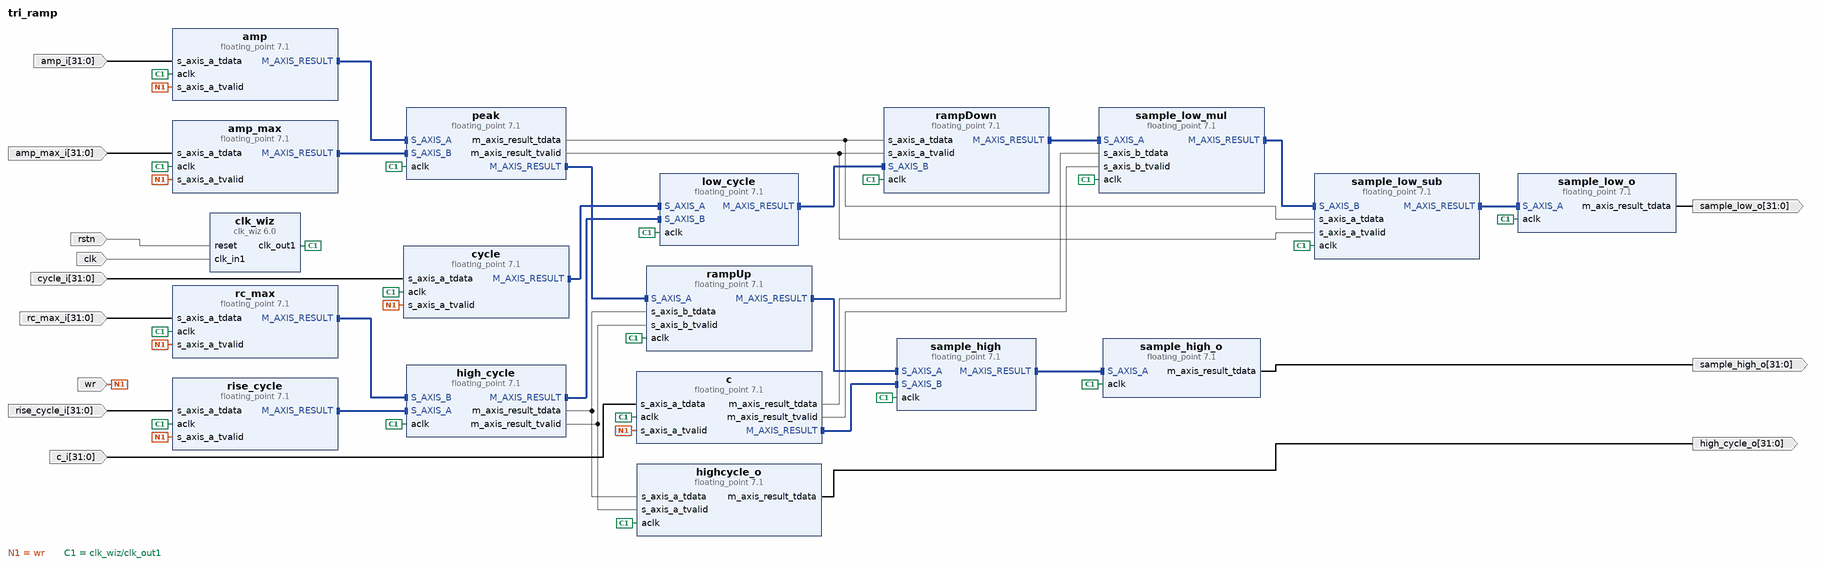
[diagram p0: block diagram of the top level]
# Vivado block design tri_ramp, xc7a100tcsg324-1, Vivado 2019.2
create_bd_design tri_ramp

create_bd_port -dir I -from 31 -to 0 rc_max_i
create_bd_port -dir I -from 31 -to 0 c_i
create_bd_port -dir I -from 31 -to 0 rise_cycle_i
create_bd_port -dir I -from 31 -to 0 amp_i
create_bd_port -dir I -from 31 -to 0 amp_max_i
create_bd_port -dir I -from 31 -to 0 cycle_i
create_bd_port -dir I wr
create_bd_port -dir O -from 31 -to 0 sample_high_o
create_bd_port -dir O -from 31 -to 0 sample_low_o
create_bd_port -dir O -from 31 -to 0 high_cycle_o
create_bd_port -dir I -type rst rstn
set_property -dict {CONFIG.POLARITY ACTIVE_HIGH} [get_bd_ports rstn]
create_bd_port -dir I -type clk clk

create_bd_cell -type ip -vlnv xilinx.com:ip:floating_point:7.1 amp
set_property -dict [list \
  CONFIG.C_Accum_Input_Msb 32 \
  CONFIG.C_Accum_Lsb -31 \
  CONFIG.C_Accum_Msb 32 \
  CONFIG.C_Latency 6 \
  CONFIG.C_Mult_Usage No_Usage \
  CONFIG.C_Rate 1 \
  CONFIG.C_Result_Exponent_Width 8 \
  CONFIG.C_Result_Fraction_Width 24 \
  CONFIG.Flow_Control NonBlocking \
  CONFIG.Has_RESULT_TREADY false \
  CONFIG.Operation_Type Fixed_to_float \
  CONFIG.Result_Precision_Type Single \
] [get_bd_cells amp]
create_bd_cell -type ip -vlnv xilinx.com:ip:floating_point:7.1 peak
set_property -dict [list \
  CONFIG.C_Accum_Input_Msb 32 \
  CONFIG.C_Accum_Lsb -31 \
  CONFIG.C_Accum_Msb 32 \
  CONFIG.C_Latency 28 \
  CONFIG.C_Mult_Usage No_Usage \
  CONFIG.C_Rate 1 \
  CONFIG.C_Result_Exponent_Width 8 \
  CONFIG.C_Result_Fraction_Width 24 \
  CONFIG.Flow_Control NonBlocking \
  CONFIG.Has_RESULT_TREADY false \
  CONFIG.Operation_Type Divide \
  CONFIG.Result_Precision_Type Single \
] [get_bd_cells peak]
create_bd_cell -type ip -vlnv xilinx.com:ip:floating_point:7.1 amp_max
set_property -dict [list \
  CONFIG.C_Accum_Input_Msb 32 \
  CONFIG.C_Accum_Lsb -31 \
  CONFIG.C_Accum_Msb 32 \
  CONFIG.C_Latency 6 \
  CONFIG.C_Mult_Usage No_Usage \
  CONFIG.C_Rate 1 \
  CONFIG.C_Result_Exponent_Width 8 \
  CONFIG.C_Result_Fraction_Width 24 \
  CONFIG.Flow_Control NonBlocking \
  CONFIG.Has_RESULT_TREADY false \
  CONFIG.Operation_Type Fixed_to_float \
  CONFIG.Result_Precision_Type Single \
] [get_bd_cells amp_max]
create_bd_cell -type ip -vlnv xilinx.com:ip:floating_point:7.1 cycle
set_property -dict [list \
  CONFIG.C_Accum_Input_Msb 32 \
  CONFIG.C_Accum_Lsb -31 \
  CONFIG.C_Accum_Msb 32 \
  CONFIG.C_Latency 6 \
  CONFIG.C_Mult_Usage No_Usage \
  CONFIG.C_Rate 1 \
  CONFIG.C_Result_Exponent_Width 8 \
  CONFIG.C_Result_Fraction_Width 24 \
  CONFIG.Flow_Control NonBlocking \
  CONFIG.Has_RESULT_TREADY false \
  CONFIG.Operation_Type Fixed_to_float \
  CONFIG.Result_Precision_Type Single \
] [get_bd_cells cycle]
create_bd_cell -type ip -vlnv xilinx.com:ip:floating_point:7.1 rc_max
set_property -dict [list \
  CONFIG.C_Accum_Input_Msb 32 \
  CONFIG.C_Accum_Lsb -31 \
  CONFIG.C_Accum_Msb 32 \
  CONFIG.C_Latency 6 \
  CONFIG.C_Mult_Usage No_Usage \
  CONFIG.C_Rate 1 \
  CONFIG.C_Result_Exponent_Width 8 \
  CONFIG.C_Result_Fraction_Width 24 \
  CONFIG.Flow_Control NonBlocking \
  CONFIG.Has_RESULT_TREADY false \
  CONFIG.Operation_Type Fixed_to_float \
  CONFIG.Result_Precision_Type Single \
] [get_bd_cells rc_max]
create_bd_cell -type ip -vlnv xilinx.com:ip:floating_point:7.1 c
set_property -dict [list \
  CONFIG.C_Accum_Input_Msb 32 \
  CONFIG.C_Accum_Lsb -31 \
  CONFIG.C_Accum_Msb 32 \
  CONFIG.C_Latency 6 \
  CONFIG.C_Mult_Usage No_Usage \
  CONFIG.C_Rate 1 \
  CONFIG.C_Result_Exponent_Width 8 \
  CONFIG.C_Result_Fraction_Width 24 \
  CONFIG.Flow_Control NonBlocking \
  CONFIG.Has_RESULT_TREADY false \
  CONFIG.Operation_Type Fixed_to_float \
  CONFIG.Result_Precision_Type Single \
] [get_bd_cells c]
create_bd_cell -type ip -vlnv xilinx.com:ip:floating_point:7.1 rise_cycle
set_property -dict [list \
  CONFIG.C_Accum_Input_Msb 32 \
  CONFIG.C_Accum_Lsb -31 \
  CONFIG.C_Accum_Msb 32 \
  CONFIG.C_Latency 6 \
  CONFIG.C_Mult_Usage No_Usage \
  CONFIG.C_Rate 1 \
  CONFIG.C_Result_Exponent_Width 8 \
  CONFIG.C_Result_Fraction_Width 24 \
  CONFIG.Flow_Control NonBlocking \
  CONFIG.Has_RESULT_TREADY false \
  CONFIG.Operation_Type Fixed_to_float \
  CONFIG.Result_Precision_Type Single \
] [get_bd_cells rise_cycle]
create_bd_cell -type ip -vlnv xilinx.com:ip:floating_point:7.1 sample_low_sub
set_property -dict [list \
  CONFIG.Add_Sub_Value Subtract \
  CONFIG.C_Accum_Input_Msb 32 \
  CONFIG.C_Accum_Lsb -31 \
  CONFIG.C_Accum_Msb 32 \
  CONFIG.C_Latency 11 \
  CONFIG.C_Mult_Usage Full_Usage \
  CONFIG.C_Rate 1 \
  CONFIG.C_Result_Exponent_Width 8 \
  CONFIG.C_Result_Fraction_Width 24 \
  CONFIG.Flow_Control NonBlocking \
  CONFIG.Has_RESULT_TREADY false \
  CONFIG.Operation_Type Add_Subtract \
  CONFIG.Result_Precision_Type Single \
] [get_bd_cells sample_low_sub]
create_bd_cell -type ip -vlnv xilinx.com:ip:floating_point:7.1 rampDown
set_property -dict [list \
  CONFIG.C_Accum_Input_Msb 32 \
  CONFIG.C_Accum_Lsb -31 \
  CONFIG.C_Accum_Msb 32 \
  CONFIG.C_Latency 28 \
  CONFIG.C_Mult_Usage No_Usage \
  CONFIG.C_Rate 1 \
  CONFIG.C_Result_Exponent_Width 8 \
  CONFIG.C_Result_Fraction_Width 24 \
  CONFIG.Flow_Control NonBlocking \
  CONFIG.Has_RESULT_TREADY false \
  CONFIG.Operation_Type Divide \
  CONFIG.Result_Precision_Type Single \
] [get_bd_cells rampDown]
create_bd_cell -type ip -vlnv xilinx.com:ip:floating_point:7.1 high_cycle
set_property -dict [list \
  CONFIG.C_Accum_Input_Msb 32 \
  CONFIG.C_Accum_Lsb -31 \
  CONFIG.C_Accum_Msb 32 \
  CONFIG.C_Latency 28 \
  CONFIG.C_Mult_Usage No_Usage \
  CONFIG.C_Rate 1 \
  CONFIG.C_Result_Exponent_Width 8 \
  CONFIG.C_Result_Fraction_Width 24 \
  CONFIG.Flow_Control NonBlocking \
  CONFIG.Has_RESULT_TREADY false \
  CONFIG.Operation_Type Divide \
  CONFIG.Result_Precision_Type Single \
] [get_bd_cells high_cycle]
create_bd_cell -type ip -vlnv xilinx.com:ip:floating_point:7.1 rampUp
set_property -dict [list \
  CONFIG.C_Accum_Input_Msb 32 \
  CONFIG.C_Accum_Lsb -31 \
  CONFIG.C_Accum_Msb 32 \
  CONFIG.C_Latency 28 \
  CONFIG.C_Mult_Usage No_Usage \
  CONFIG.C_Rate 1 \
  CONFIG.C_Result_Exponent_Width 8 \
  CONFIG.C_Result_Fraction_Width 24 \
  CONFIG.Flow_Control NonBlocking \
  CONFIG.Has_RESULT_TREADY false \
  CONFIG.Operation_Type Divide \
  CONFIG.Result_Precision_Type Single \
] [get_bd_cells rampUp]
create_bd_cell -type ip -vlnv xilinx.com:ip:floating_point:7.1 sample_low_mul
set_property -dict [list \
  CONFIG.C_Accum_Input_Msb 32 \
  CONFIG.C_Accum_Lsb -31 \
  CONFIG.C_Accum_Msb 32 \
  CONFIG.C_Latency 28 \
  CONFIG.C_Mult_Usage No_Usage \
  CONFIG.C_Rate 1 \
  CONFIG.C_Result_Exponent_Width 8 \
  CONFIG.C_Result_Fraction_Width 24 \
  CONFIG.Flow_Control NonBlocking \
  CONFIG.Has_RESULT_TREADY false \
  CONFIG.Operation_Type Divide \
  CONFIG.Result_Precision_Type Single \
] [get_bd_cells sample_low_mul]
create_bd_cell -type ip -vlnv xilinx.com:ip:floating_point:7.1 low_cycle
set_property -dict [list \
  CONFIG.Add_Sub_Value Subtract \
  CONFIG.C_Accum_Input_Msb 32 \
  CONFIG.C_Accum_Lsb -31 \
  CONFIG.C_Accum_Msb 32 \
  CONFIG.C_Latency 11 \
  CONFIG.C_Mult_Usage Full_Usage \
  CONFIG.C_Rate 1 \
  CONFIG.C_Result_Exponent_Width 8 \
  CONFIG.C_Result_Fraction_Width 24 \
  CONFIG.Flow_Control NonBlocking \
  CONFIG.Has_RESULT_TREADY false \
  CONFIG.Operation_Type Add_Subtract \
  CONFIG.Result_Precision_Type Single \
] [get_bd_cells low_cycle]
create_bd_cell -type ip -vlnv xilinx.com:ip:floating_point:7.1 sample_high
set_property -dict [list \
  CONFIG.C_Accum_Input_Msb 32 \
  CONFIG.C_Accum_Lsb -31 \
  CONFIG.C_Accum_Msb 32 \
  CONFIG.C_Latency 28 \
  CONFIG.C_Mult_Usage No_Usage \
  CONFIG.C_Rate 1 \
  CONFIG.C_Result_Exponent_Width 8 \
  CONFIG.C_Result_Fraction_Width 24 \
  CONFIG.Flow_Control NonBlocking \
  CONFIG.Has_RESULT_TREADY false \
  CONFIG.Operation_Type Divide \
  CONFIG.Result_Precision_Type Single \
] [get_bd_cells sample_high]
create_bd_cell -type ip -vlnv xilinx.com:ip:floating_point:7.1 highcycle_o
set_property -dict [list \
  CONFIG.C_Accum_Input_Msb 32 \
  CONFIG.C_Accum_Lsb -31 \
  CONFIG.C_Accum_Msb 32 \
  CONFIG.C_Latency 6 \
  CONFIG.C_Mult_Usage No_Usage \
  CONFIG.C_Rate 1 \
  CONFIG.C_Result_Exponent_Width 32 \
  CONFIG.C_Result_Fraction_Width 0 \
  CONFIG.Flow_Control NonBlocking \
  CONFIG.Has_RESULT_TREADY false \
  CONFIG.Operation_Type Float_to_fixed \
  CONFIG.Result_Precision_Type Int32 \
] [get_bd_cells highcycle_o]
create_bd_cell -type ip -vlnv xilinx.com:ip:floating_point:7.1 sample_high_o
set_property -dict [list \
  CONFIG.C_Accum_Input_Msb 32 \
  CONFIG.C_Accum_Lsb -31 \
  CONFIG.C_Accum_Msb 32 \
  CONFIG.C_Latency 6 \
  CONFIG.C_Mult_Usage No_Usage \
  CONFIG.C_Rate 1 \
  CONFIG.C_Result_Exponent_Width 32 \
  CONFIG.C_Result_Fraction_Width 0 \
  CONFIG.Flow_Control NonBlocking \
  CONFIG.Has_RESULT_TREADY false \
  CONFIG.Operation_Type Float_to_fixed \
  CONFIG.Result_Precision_Type Int32 \
] [get_bd_cells sample_high_o]
create_bd_cell -type ip -vlnv xilinx.com:ip:floating_point:7.1 sample_low_o
set_property -dict [list \
  CONFIG.C_Accum_Input_Msb 32 \
  CONFIG.C_Accum_Lsb -31 \
  CONFIG.C_Accum_Msb 32 \
  CONFIG.C_Latency 6 \
  CONFIG.C_Mult_Usage No_Usage \
  CONFIG.C_Rate 1 \
  CONFIG.C_Result_Exponent_Width 32 \
  CONFIG.C_Result_Fraction_Width 0 \
  CONFIG.Flow_Control NonBlocking \
  CONFIG.Has_RESULT_TREADY false \
  CONFIG.Operation_Type Float_to_fixed \
  CONFIG.Result_Precision_Type Int32 \
] [get_bd_cells sample_low_o]
create_bd_cell -type ip -vlnv xilinx.com:ip:clk_wiz:6.0 clk_wiz

# ---- connections ----

connect_bd_intf_net [get_bd_intf_pins sample_high/S_AXIS_B] [get_bd_intf_pins c/M_AXIS_RESULT]
connect_bd_intf_net [get_bd_intf_pins rampUp/M_AXIS_RESULT] [get_bd_intf_pins sample_high/S_AXIS_A]
connect_bd_intf_net [get_bd_intf_pins amp/M_AXIS_RESULT] [get_bd_intf_pins peak/S_AXIS_A]
connect_bd_intf_net [get_bd_intf_pins rise_cycle/M_AXIS_RESULT] [get_bd_intf_pins high_cycle/S_AXIS_A]
connect_bd_intf_net [get_bd_intf_pins amp_max/M_AXIS_RESULT] [get_bd_intf_pins peak/S_AXIS_B]
connect_bd_intf_net [get_bd_intf_pins rc_max/M_AXIS_RESULT] [get_bd_intf_pins high_cycle/S_AXIS_B]
connect_bd_intf_net [get_bd_intf_pins low_cycle/M_AXIS_RESULT] [get_bd_intf_pins rampDown/S_AXIS_B]
connect_bd_intf_net [get_bd_intf_pins cycle/M_AXIS_RESULT] [get_bd_intf_pins low_cycle/S_AXIS_A]
connect_bd_intf_net [get_bd_intf_pins high_cycle/M_AXIS_RESULT] [get_bd_intf_pins low_cycle/S_AXIS_B]
connect_bd_intf_net [get_bd_intf_pins peak/M_AXIS_RESULT] [get_bd_intf_pins rampUp/S_AXIS_A]
connect_bd_intf_net [get_bd_intf_pins sample_low_mul/M_AXIS_RESULT] [get_bd_intf_pins sample_low_sub/S_AXIS_B]
connect_bd_intf_net [get_bd_intf_pins rampDown/M_AXIS_RESULT] [get_bd_intf_pins sample_low_mul/S_AXIS_A]
connect_bd_intf_net [get_bd_intf_pins sample_high_o/S_AXIS_A] [get_bd_intf_pins sample_high/M_AXIS_RESULT]
connect_bd_intf_net [get_bd_intf_pins sample_low_o/S_AXIS_A] [get_bd_intf_pins sample_low_sub/M_AXIS_RESULT]
connect_bd_net -net s_axis_a_tdata_0_1 [get_bd_ports rc_max_i] [get_bd_pins rc_max/s_axis_a_tdata]
connect_bd_net -net s_axis_a_tdata_1_1 [get_bd_ports c_i] [get_bd_pins c/s_axis_a_tdata]
connect_bd_net -net s_axis_a_tdata_2_1 [get_bd_ports rise_cycle_i] [get_bd_pins rise_cycle/s_axis_a_tdata]
connect_bd_net -net s_axis_a_tdata_3_1 [get_bd_ports amp_i] [get_bd_pins amp/s_axis_a_tdata]
connect_bd_net -net s_axis_a_tdata_4_1 [get_bd_ports amp_max_i] [get_bd_pins amp_max/s_axis_a_tdata]
connect_bd_net -net s_axis_a_tdata_5_1 [get_bd_ports cycle_i] [get_bd_pins cycle/s_axis_a_tdata]
connect_bd_net -net s_axis_a_tvalid_0_1 [get_bd_ports wr] \
  [get_bd_pins amp/s_axis_a_tvalid] [get_bd_pins amp_max/s_axis_a_tvalid] [get_bd_pins rise_cycle/s_axis_a_tvalid] \
  [get_bd_pins rc_max/s_axis_a_tvalid] [get_bd_pins c/s_axis_a_tvalid] [get_bd_pins cycle/s_axis_a_tvalid]
connect_bd_net [get_bd_pins sample_high_o/m_axis_result_tdata] [get_bd_ports sample_high_o]
connect_bd_net [get_bd_pins sample_low_o/m_axis_result_tdata] [get_bd_ports sample_low_o]
connect_bd_net [get_bd_pins highcycle_o/m_axis_result_tdata] [get_bd_ports high_cycle_o]
connect_bd_net [get_bd_pins high_cycle/m_axis_result_tdata] [get_bd_pins rampUp/s_axis_b_tdata] [get_bd_pins highcycle_o/s_axis_a_tdata]
connect_bd_net [get_bd_pins high_cycle/m_axis_result_tvalid] [get_bd_pins rampUp/s_axis_b_tvalid] [get_bd_pins highcycle_o/s_axis_a_tvalid]
connect_bd_net [get_bd_pins peak/m_axis_result_tdata] [get_bd_pins rampDown/s_axis_a_tdata] [get_bd_pins sample_low_sub/s_axis_a_tdata]
connect_bd_net [get_bd_pins peak/m_axis_result_tvalid] [get_bd_pins rampDown/s_axis_a_tvalid] [get_bd_pins sample_low_sub/s_axis_a_tvalid]
connect_bd_net [get_bd_pins c/m_axis_result_tdata] [get_bd_pins sample_low_mul/s_axis_b_tdata]
connect_bd_net [get_bd_pins c/m_axis_result_tvalid] [get_bd_pins sample_low_mul/s_axis_b_tvalid]
connect_bd_net [get_bd_pins clk_wiz/clk_out1] \
  [get_bd_pins high_cycle/aclk] [get_bd_pins low_cycle/aclk] [get_bd_pins rc_max/aclk] [get_bd_pins rise_cycle/aclk] \
  [get_bd_pins amp/aclk] [get_bd_pins amp_max/aclk] [get_bd_pins c/aclk] [get_bd_pins cycle/aclk] \
  [get_bd_pins sample_low_mul/aclk] [get_bd_pins rampDown/aclk] [get_bd_pins rampUp/aclk] [get_bd_pins sample_high/aclk] \
  [get_bd_pins sample_low_sub/aclk] [get_bd_pins sample_low_o/aclk] [get_bd_pins sample_high_o/aclk] \
  [get_bd_pins highcycle_o/aclk] [get_bd_pins peak/aclk]
connect_bd_net -net reset_0_1 [get_bd_ports rstn] [get_bd_pins clk_wiz/reset]
connect_bd_net -net clk_in1_0_1 [get_bd_ports clk] [get_bd_pins clk_wiz/clk_in1]

validate_bd_design
save_bd_design
